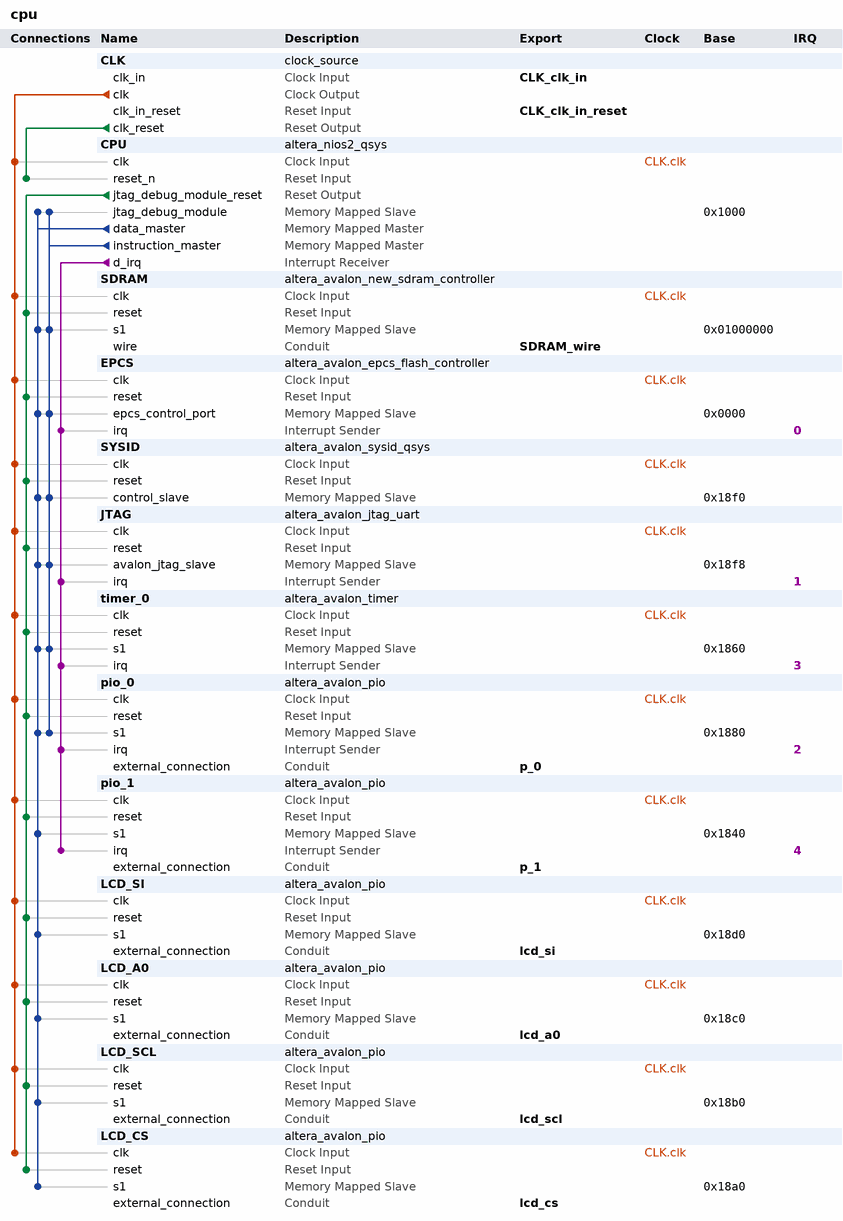
[diagram p0: system contents]
# Platform Designer (Qsys) system cpu, Cyclone II EP2C8Q208C8
# Parameters at their usual value, and those the tool derives, are not listed.
package require -exact qsys 13.0.1
create_system cpu
set_project_property DEVICE_FAMILY {Cyclone II}
set_project_property DEVICE EP2C8Q208C8

add_instance CLK clock_source 13.0
set_instance_parameter_value CLK clockFrequency 100000000

add_instance CPU altera_nios2_qsys 13.0
set_instance_parameter_value CPU manuallyAssignCpuID false
set_instance_parameter_value CPU resetSlave EPCS.epcs_control_port
set_instance_parameter_value CPU mmu_TLBMissExcSlave None
set_instance_parameter_value CPU exceptionSlave SDRAM.s1
set_instance_parameter_value CPU breakSlave CPU.jtag_debug_module
set_instance_parameter_value CPU impl Fast
set_instance_parameter_value CPU icache_size 4096
set_instance_parameter_value CPU dcache_size 0

add_instance SDRAM altera_avalon_new_sdram_controller 13.0.1
set_instance_parameter_value SDRAM TAC 5.5
set_instance_parameter_value SDRAM TRCD 20.0
set_instance_parameter_value SDRAM TRP 20.0
set_instance_parameter_value SDRAM casLatency 3
set_instance_parameter_value SDRAM columnWidth 8
set_instance_parameter_value SDRAM dataWidth 16
set_instance_parameter_value SDRAM generateSimulationModel false
set_instance_parameter_value SDRAM model single_Micron_MT48LC4M32B2_7_chip
set_instance_parameter_value SDRAM numberOfBanks 4
set_instance_parameter_value SDRAM numberOfChipSelects 1
set_instance_parameter_value SDRAM powerUpDelay 100.0
set_instance_parameter_value SDRAM refreshPeriod 15.625
set_instance_parameter_value SDRAM rowWidth 12

add_instance EPCS altera_avalon_epcs_flash_controller 13.0.1

add_instance SYSID altera_avalon_sysid_qsys 13.0
set_instance_parameter_value SYSID id 0

add_instance JTAG altera_avalon_jtag_uart 13.0.1
set_instance_parameter_value JTAG simInteractiveOptions NO_INTERACTIVE_WINDOWS

add_instance timer_0 altera_avalon_timer 13.0.1
set_instance_parameter_value timer_0 period 1
set_instance_parameter_value timer_0 periodUnits MSEC

add_instance pio_0 altera_avalon_pio 13.0.1
set_instance_parameter_value pio_0 bitModifyingOutReg true
set_instance_parameter_value pio_0 direction Bidir
set_instance_parameter_value pio_0 generateIRQ true
set_instance_parameter_value pio_0 width 16

add_instance pio_1 altera_avalon_pio 13.0.1
set_instance_parameter_value pio_1 bitModifyingOutReg true
set_instance_parameter_value pio_1 direction Bidir
set_instance_parameter_value pio_1 generateIRQ true
set_instance_parameter_value pio_1 width 16

add_instance LCD_SI altera_avalon_pio 13.0.1
set_instance_parameter_value LCD_SI direction Output
set_instance_parameter_value LCD_SI width 1

add_instance LCD_A0 altera_avalon_pio 13.0.1
set_instance_parameter_value LCD_A0 direction Output
set_instance_parameter_value LCD_A0 width 1

add_instance LCD_SCL altera_avalon_pio 13.0.1
set_instance_parameter_value LCD_SCL direction Output
set_instance_parameter_value LCD_SCL width 1

add_instance LCD_CS altera_avalon_pio 13.0.1
set_instance_parameter_value LCD_CS direction Output
set_instance_parameter_value LCD_CS width 1

# connections
add_connection CLK.clk CPU.clk clock
add_connection CLK.clk EPCS.clk clock
add_connection CLK.clk JTAG.clk clock
add_connection CLK.clk LCD_A0.clk clock
add_connection CLK.clk LCD_CS.clk clock
add_connection CLK.clk LCD_SCL.clk clock
add_connection CLK.clk LCD_SI.clk clock
add_connection CLK.clk pio_0.clk clock
add_connection CLK.clk pio_1.clk clock
add_connection CLK.clk SDRAM.clk clock
add_connection CLK.clk SYSID.clk clock
add_connection CLK.clk timer_0.clk clock
add_connection CLK.clk_reset CPU.reset_n reset
add_connection CPU.jtag_debug_module_reset EPCS.reset reset
add_connection CPU.jtag_debug_module_reset JTAG.reset reset
add_connection CPU.jtag_debug_module_reset LCD_A0.reset reset
add_connection CPU.jtag_debug_module_reset LCD_CS.reset reset
add_connection CPU.jtag_debug_module_reset LCD_SCL.reset reset
add_connection CPU.jtag_debug_module_reset LCD_SI.reset reset
add_connection CPU.jtag_debug_module_reset pio_0.reset reset
add_connection CPU.jtag_debug_module_reset pio_1.reset reset
add_connection CPU.jtag_debug_module_reset SDRAM.reset reset
add_connection CPU.jtag_debug_module_reset SYSID.reset reset
add_connection CPU.jtag_debug_module_reset timer_0.reset reset
add_connection CPU.data_master CPU.jtag_debug_module avalon
set_connection_parameter_value CPU.data_master/CPU.jtag_debug_module baseAddress 0x1000
add_connection CPU.data_master EPCS.epcs_control_port avalon
set_connection_parameter_value CPU.data_master/EPCS.epcs_control_port baseAddress 0x0000
add_connection CPU.data_master JTAG.avalon_jtag_slave avalon
set_connection_parameter_value CPU.data_master/JTAG.avalon_jtag_slave baseAddress 0x18f8
add_connection CPU.data_master LCD_A0.s1 avalon
set_connection_parameter_value CPU.data_master/LCD_A0.s1 baseAddress 0x18c0
add_connection CPU.data_master LCD_CS.s1 avalon
set_connection_parameter_value CPU.data_master/LCD_CS.s1 baseAddress 0x18a0
add_connection CPU.data_master LCD_SCL.s1 avalon
set_connection_parameter_value CPU.data_master/LCD_SCL.s1 baseAddress 0x18b0
add_connection CPU.data_master LCD_SI.s1 avalon
set_connection_parameter_value CPU.data_master/LCD_SI.s1 baseAddress 0x18d0
add_connection CPU.data_master pio_0.s1 avalon
set_connection_parameter_value CPU.data_master/pio_0.s1 baseAddress 0x1880
add_connection CPU.data_master pio_1.s1 avalon
set_connection_parameter_value CPU.data_master/pio_1.s1 baseAddress 0x1840
add_connection CPU.data_master SDRAM.s1 avalon
set_connection_parameter_value CPU.data_master/SDRAM.s1 baseAddress 0x01000000
add_connection CPU.data_master SYSID.control_slave avalon
set_connection_parameter_value CPU.data_master/SYSID.control_slave baseAddress 0x18f0
add_connection CPU.data_master timer_0.s1 avalon
set_connection_parameter_value CPU.data_master/timer_0.s1 baseAddress 0x1860
add_connection CPU.instruction_master CPU.jtag_debug_module avalon
set_connection_parameter_value CPU.instruction_master/CPU.jtag_debug_module baseAddress 0x1000
add_connection CPU.instruction_master EPCS.epcs_control_port avalon
set_connection_parameter_value CPU.instruction_master/EPCS.epcs_control_port baseAddress 0x0000
add_connection CPU.instruction_master JTAG.avalon_jtag_slave avalon
set_connection_parameter_value CPU.instruction_master/JTAG.avalon_jtag_slave baseAddress 0x18f8
add_connection CPU.instruction_master pio_0.s1 avalon
set_connection_parameter_value CPU.instruction_master/pio_0.s1 baseAddress 0x1880
add_connection CPU.instruction_master SDRAM.s1 avalon
set_connection_parameter_value CPU.instruction_master/SDRAM.s1 baseAddress 0x01000000
add_connection CPU.instruction_master SYSID.control_slave avalon
set_connection_parameter_value CPU.instruction_master/SYSID.control_slave baseAddress 0x18f0
add_connection CPU.instruction_master timer_0.s1 avalon
set_connection_parameter_value CPU.instruction_master/timer_0.s1 baseAddress 0x1860
add_connection CPU.d_irq EPCS.irq interrupt
set_connection_parameter_value CPU.d_irq/EPCS.irq irqNumber 0
add_connection CPU.d_irq JTAG.irq interrupt
set_connection_parameter_value CPU.d_irq/JTAG.irq irqNumber 1
add_connection CPU.d_irq pio_0.irq interrupt
set_connection_parameter_value CPU.d_irq/pio_0.irq irqNumber 2
add_connection CPU.d_irq pio_1.irq interrupt
set_connection_parameter_value CPU.d_irq/pio_1.irq irqNumber 4
add_connection CPU.d_irq timer_0.irq interrupt
set_connection_parameter_value CPU.d_irq/timer_0.irq irqNumber 3

# exported interfaces
add_interface CLK_clk_in clock sink
set_interface_property CLK_clk_in EXPORT_OF CLK.clk_in
add_interface SDRAM_wire conduit end
set_interface_property SDRAM_wire EXPORT_OF SDRAM.wire
add_interface CLK_clk_in_reset reset sink
set_interface_property CLK_clk_in_reset EXPORT_OF CLK.clk_in_reset
add_interface p_0 conduit end
set_interface_property p_0 EXPORT_OF pio_0.external_connection
add_interface p_1 conduit end
set_interface_property p_1 EXPORT_OF pio_1.external_connection
add_interface lcd_si conduit end
set_interface_property lcd_si EXPORT_OF LCD_SI.external_connection
add_interface lcd_a0 conduit end
set_interface_property lcd_a0 EXPORT_OF LCD_A0.external_connection
add_interface lcd_scl conduit end
set_interface_property lcd_scl EXPORT_OF LCD_SCL.external_connection
add_interface lcd_cs conduit end
set_interface_property lcd_cs EXPORT_OF LCD_CS.external_connection

set_interconnect_requirement {$system} qsys_mm.clockCrossingAdapter HANDSHAKE
set_interconnect_requirement {$system} qsys_mm.maxAdditionalLatency 0

save_system cpu.qsys
